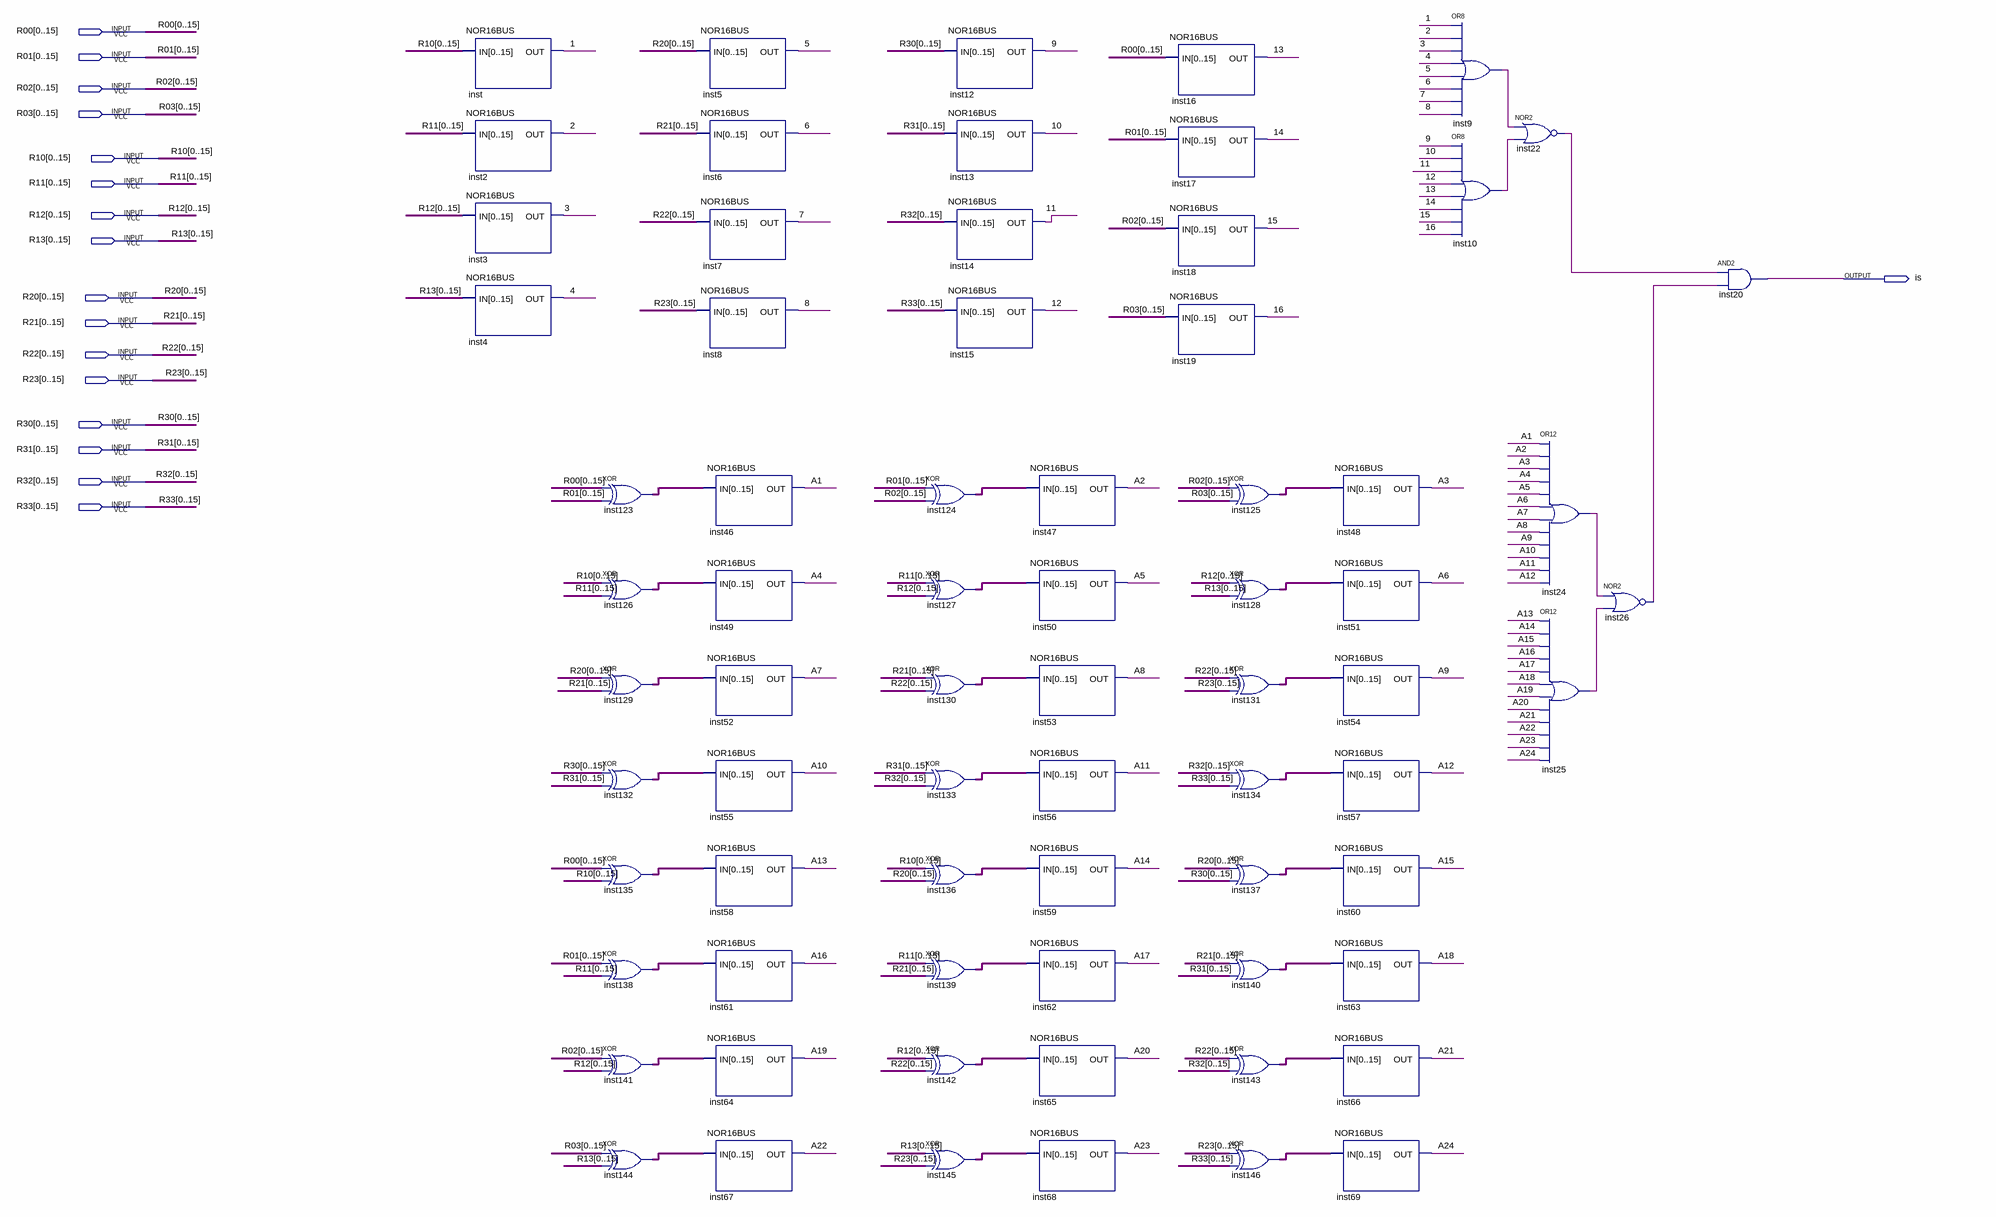
[diagram p0: schematic sheet]
// Quartus schematic GameOver.bdf as structural Verilog: 71 symbols, 17 pins
module GameOver (
  input  [0:15] R00,
  input  [0:15] R01,
  input  [0:15] R02,
  input  [0:15] R03,
  input  [0:15] R10,
  input  [0:15] R11,
  input  [0:15] R12,
  input  [0:15] R13,
  input  [0:15] R20,
  input  [0:15] R21,
  input  [0:15] R22,
  input  [0:15] R23,
  input  [0:15] R30,
  input  [0:15] R31,
  input  [0:15] R32,
  input  [0:15] R33,
  output is
);

  wire \1 , \2 , \3 , \4 , \5 , \6 , \7 , \8 , \9 , \10 , \11 , \12 , \13 , \14 , \15 , \16 , A1, A2, A3, A4,
       A5, A6, A7, A8, A9, A10, A11, A12, A13, A14, A15, A16, A17, A18, A19, A20, A21, A22, A23, A24,
       inst9_out, inst10_out, inst22_out, inst24_out, inst25_out, inst26_out;
  wire [15:0] inst123_out, inst124_out, inst125_out, inst126_out, inst127_out, inst128_out, inst129_out,
       inst130_out, inst131_out, inst132_out, inst133_out, inst134_out, inst135_out, inst136_out,
       inst137_out, inst138_out, inst139_out, inst140_out, inst141_out, inst142_out, inst143_out,
       inst144_out, inst145_out, inst146_out;

  NOR16BUS inst (.IN(R10), .OUT(\1 ));
  NOR16BUS inst2 (.IN(R11), .OUT(\2 ));
  NOR16BUS inst3 (.IN(R12), .OUT(\3 ));
  NOR16BUS inst4 (.IN(R13), .OUT(\4 ));
  assign inst123_out = R00 ^ R01;  // XOR inst123, 16 bits wide
  assign inst126_out = R10 ^ R11;  // XOR inst126, 16 bits wide
  assign inst129_out = R20 ^ R21;  // XOR inst129, 16 bits wide
  assign inst132_out = R30 ^ R31;  // XOR inst132, 16 bits wide
  assign inst135_out = R00 ^ R10;  // XOR inst135, 16 bits wide
  assign inst138_out = R01 ^ R11;  // XOR inst138, 16 bits wide
  assign inst141_out = R02 ^ R12;  // XOR inst141, 16 bits wide
  assign inst144_out = R03 ^ R13;  // XOR inst144, 16 bits wide
  NOR16BUS inst5 (.IN(R20), .OUT(\5 ));
  NOR16BUS inst6 (.IN(R21), .OUT(\6 ));
  NOR16BUS inst7 (.IN(R22), .OUT(\7 ));
  NOR16BUS inst8 (.IN(R23), .OUT(\8 ));
  NOR16BUS inst46 (.IN(inst123_out), .OUT(A1));
  NOR16BUS inst49 (.IN(inst126_out), .OUT(A4));
  NOR16BUS inst52 (.IN(inst129_out), .OUT(A7));
  NOR16BUS inst55 (.IN(inst132_out), .OUT(A10));
  NOR16BUS inst58 (.IN(inst135_out), .OUT(A13));
  NOR16BUS inst61 (.IN(inst138_out), .OUT(A16));
  NOR16BUS inst64 (.IN(inst141_out), .OUT(A19));
  NOR16BUS inst67 (.IN(inst144_out), .OUT(A22));
  assign inst124_out = R01 ^ R02;  // XOR inst124, 16 bits wide
  assign inst127_out = R11 ^ R12;  // XOR inst127, 16 bits wide
  assign inst130_out = R21 ^ R22;  // XOR inst130, 16 bits wide
  assign inst133_out = R31 ^ R32;  // XOR inst133, 16 bits wide
  assign inst136_out = R10 ^ R20;  // XOR inst136, 16 bits wide
  assign inst139_out = R11 ^ R21;  // XOR inst139, 16 bits wide
  assign inst142_out = R12 ^ R22;  // XOR inst142, 16 bits wide
  assign inst145_out = R13 ^ R23;  // XOR inst145, 16 bits wide
  NOR16BUS inst12 (.IN(R30), .OUT(\9 ));
  NOR16BUS inst13 (.IN(R31), .OUT(\10 ));
  NOR16BUS inst14 (.IN(R32), .OUT(\11 ));
  NOR16BUS inst15 (.IN(R33), .OUT(\12 ));
  NOR16BUS inst47 (.IN(inst124_out), .OUT(A2));
  NOR16BUS inst50 (.IN(inst127_out), .OUT(A5));
  NOR16BUS inst53 (.IN(inst130_out), .OUT(A8));
  NOR16BUS inst56 (.IN(inst133_out), .OUT(A11));
  NOR16BUS inst59 (.IN(inst136_out), .OUT(A14));
  NOR16BUS inst62 (.IN(inst139_out), .OUT(A17));
  NOR16BUS inst65 (.IN(inst142_out), .OUT(A20));
  NOR16BUS inst68 (.IN(inst145_out), .OUT(A23));
  NOR16BUS inst16 (.IN(R00), .OUT(\13 ));
  NOR16BUS inst17 (.IN(R01), .OUT(\14 ));
  NOR16BUS inst18 (.IN(R02), .OUT(\15 ));
  NOR16BUS inst19 (.IN(R03), .OUT(\16 ));
  assign inst125_out = R02 ^ R03;  // XOR inst125, 16 bits wide
  assign inst128_out = R12 ^ R13;  // XOR inst128, 16 bits wide
  assign inst131_out = R22 ^ R23;  // XOR inst131, 16 bits wide
  assign inst134_out = R32 ^ R33;  // XOR inst134, 16 bits wide
  assign inst137_out = R20 ^ R30;  // XOR inst137, 16 bits wide
  assign inst140_out = R21 ^ R31;  // XOR inst140, 16 bits wide
  assign inst143_out = R22 ^ R32;  // XOR inst143, 16 bits wide
  assign inst146_out = R23 ^ R33;  // XOR inst146, 16 bits wide
  NOR16BUS inst48 (.IN(inst125_out), .OUT(A3));
  NOR16BUS inst51 (.IN(inst128_out), .OUT(A6));
  NOR16BUS inst54 (.IN(inst131_out), .OUT(A9));
  NOR16BUS inst57 (.IN(inst134_out), .OUT(A12));
  NOR16BUS inst60 (.IN(inst137_out), .OUT(A15));
  NOR16BUS inst63 (.IN(inst140_out), .OUT(A18));
  NOR16BUS inst66 (.IN(inst143_out), .OUT(A21));
  NOR16BUS inst69 (.IN(inst146_out), .OUT(A24));
  or inst9 (inst9_out, \1 , \2 , \3 , \4 , \5 , \6 , \7 , \8 );
  or inst10 (inst10_out, \9 , \10 , \11 , \12 , \13 , \14 , \15 , \16 );
  nor inst22 (inst22_out, inst9_out, inst10_out);
  or inst24 (inst24_out, A1, A2, A3, A4, A5, A6, A7, A8, A9, A10, A11, A12);
  or inst25 (inst25_out, A13, A14, A15, A16, A17, A18, A19, A20, A21, A22, A23, A24);
  nor inst26 (inst26_out, inst24_out, inst25_out);
  and inst20 (is, inst22_out, inst26_out);
endmodule
